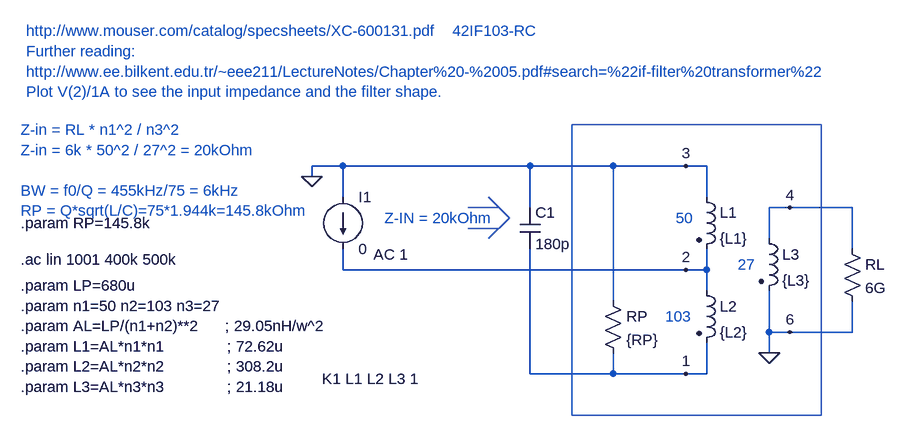
[diagram p0: schematic IF_filter455k.asc]
IF_filter455k.asc, the LTspice schematic file:
Version 4
SHEET 1 1228 680
WIRE -256 80 -304 80
WIRE 32 80 -256 80
WIRE 160 80 32 80
WIRE 272 80 160 80
WIRE 304 80 272 80
WIRE -304 96 -304 80
WIRE -256 128 -256 80
WIRE 304 128 304 80
WIRE 32 144 32 80
WIRE 432 144 400 144
WIRE 528 144 432 144
WIRE 400 192 400 144
WIRE 528 208 528 144
WIRE -256 240 -256 208
WIRE 272 240 -256 240
WIRE 304 240 304 208
WIRE 304 240 272 240
WIRE 304 272 304 240
WIRE 160 288 160 80
WIRE 400 336 400 272
WIRE 432 336 400 336
WIRE 528 336 528 288
WIRE 528 336 432 336
WIRE 400 368 400 336
WIRE 32 400 32 208
WIRE 160 400 160 368
WIRE 160 400 32 400
WIRE 272 400 160 400
WIRE 304 400 304 352
WIRE 304 400 272 400
FLAG 272 80 3
FLAG 272 240 2
FLAG 272 400 1
FLAG 432 144 4
FLAG 432 336 6
FLAG 400 368 0
FLAG -304 96 0
SYMBOL ind2 288 112 R0
SYMATTR InstName L1
SYMATTR Value {L1}
SYMATTR Type ind
SYMBOL ind2 288 256 R0
SYMATTR InstName L2
SYMATTR Value {L2}
SYMATTR Type ind
SYMBOL ind2 384 176 R0
SYMATTR InstName L3
SYMATTR Value {L3}
SYMATTR Type ind
SYMBOL res 512 192 R0
SYMATTR InstName RL
SYMATTR Value 6G
SYMBOL cap 16 144 R0
SYMATTR InstName C1
SYMATTR Value 180p
SYMBOL current -256 128 R0
WINDOW 123 47 88 Left 0
WINDOW 39 0 0 Left 0
SYMATTR InstName I1
SYMATTR Value 0
SYMATTR Value2 AC 1
SYMBOL res 144 272 R0
SYMATTR InstName RP
SYMATTR Value {RP}
TEXT 240 312 Left 0 ;103
TEXT 256 160 Left 0 ;50
TEXT 352 232 Left 0 ;27
TEXT -752 264 Left 0 !.param LP=680u\n.param n1=50 n2=103 n3=27\n.param AL=LP/(n1+n2)**2      ; 29.05nH/w^2\n.param L1=AL*n1*n1              ; 72.62u\n.param L2=AL*n2*n2              ; 308.2u\n.param L3=AL*n3*n3              ; 21.18u
TEXT -752 224 Left 0 !.ac lin 1001 400k 500k
TEXT -288 408 Left 0 !K1 L1 L2 L3 1
TEXT -192 160 Left 0 ;Z-IN = 20kOhm
TEXT -752 24 Left 0 ;Z-in = RL * n1^2 / n3^2\nZ-in = 6k * 50^2 / 27^2 = 20kOhm\n  \nBW = f0/Q = 455kHz/75 = 6kHz\nRP = Q*sqrt(L/C)=75*1.944k=145.8kOhm
TEXT -744 -128 Left 0 ;http://www.mouser.com/catalog/specsheets/XC-600131.pdf    42IF103-RC\nFurther reading: \nhttp://www.ee.bilkent.edu.tr/~eee211/LectureNotes/Chapter%20-%2005.pdf#search=%22if-filter%20transformer%22\nPlot V(2)/1A to see the input impedance and the filter shape.
TEXT -752 168 Left 0 !.param RP=145.8k
LINE Normal -16 144 -64 144
LINE Normal -16 176 -64 176
LINE Normal -32 192 0 160
LINE Normal -32 128 0 160
RECTANGLE Normal 480 464 96 16

The netlist it stands for:
* IF_filter455k.asc
L1 0 2 {L1}
L2 2 1 {L2}
L3 4 0 {L3}
RL 4 0 6G
C1 0 1 180p
I1 0 2 0 AC 1
RP 0 1 {RP}
* 103
* 50
* 27
.param LP=680u
.param n1=50 n2=103 n3=27
.param AL=LP/(n1+n2)**2      ; 29.05nH/w^2
.param L1=AL*n1*n1              ; 72.62u
.param L2=AL*n2*n2              ; 308.2u
.param L3=AL*n3*n3              ; 21.18u
.ac lin 1001 400k 500k
K1 L1 L2 L3 1
* Z-IN = 20kOhm
* Z-in = RL * n1^2 / n3^2
* Z-in = 6k * 50^2 / 27^2 = 20kOhm
* BW = f0/Q = 455kHz/75 = 6kHz
* RP = Q*sqrt(L/C)=75*1.944k=145.8kOhm
* http://www.mouser.com/catalog/specsheets/XC-600131.pdf    42IF103-RC
* Further reading:
* http://www.ee.bilkent.edu.tr/~eee211/LectureNotes/Chapter%20-%2005.pdf#search=%22if-filter%20transformer%22
* Plot V(2)/1A to see the input impedance and the filter shape.
.param RP=145.8k
.backanno
.end